# Altium schematic sheet TBD_Sensor.SchDoc
size A4; SheetNumber: 5; SheetTotal: 7
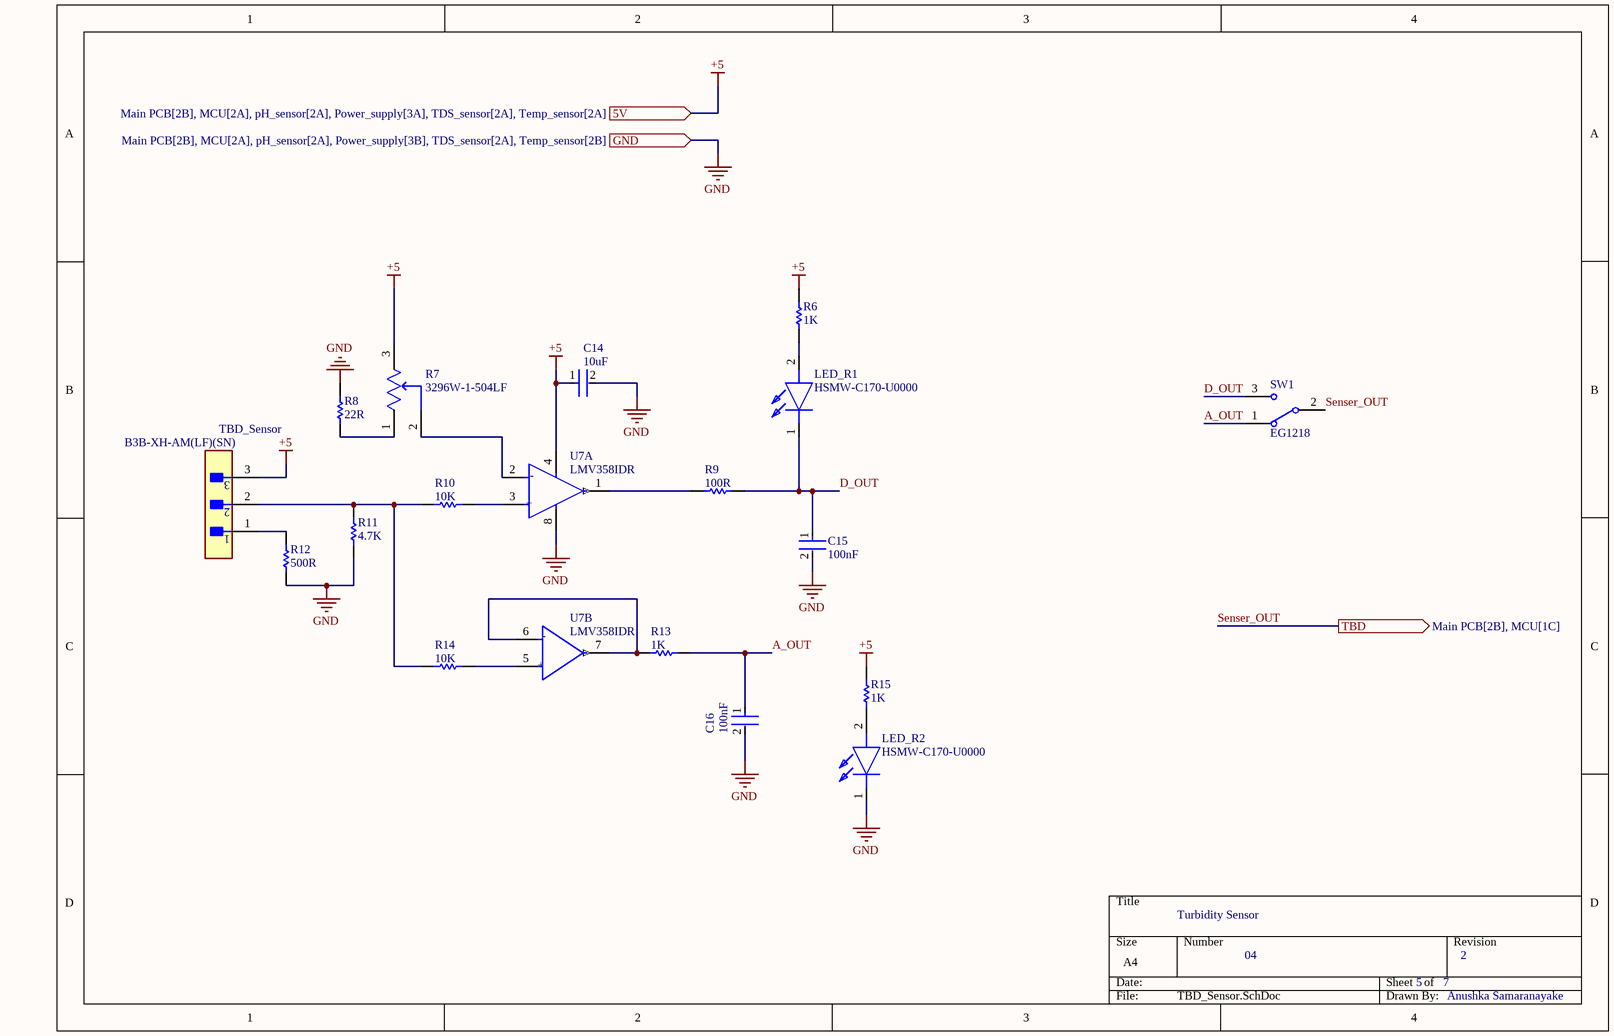
[diagram p0: TBD_Sensor.SchDoc]

## Parts
C14  10uF  [FP-CL31-IPC_B]
C15  100nF  [FP-CL31-IPC_B]
C16  100nF  [FP-CL31-IPC_B]
LED_R1  HSMW-C170-U0000  [LEDC2012X90N]
LED_R2  HSMW-C170-U0000  [LEDC2012X90N]
R6  1K  [RESC3216X70X50LL20T25]
R7  3296W-1-504LF  [FP-3296W-MFG]
R8  22R  [RESC2013X60X35ML10T20]
R9  100R  [RESC2013X60X35ML10T20]
R10  10K  [RESC3216X70X50LL20T25]
R11  4.7K  [RESC3216X70X50LL20T25]
R12  500R  [RESC2013X60X35ML10T20]
R13  1K  [RESC3216X70X50LL20T25]
R14  10K  [RESC3216X70X50LL20T25]
R15  1K  [RESC3216X70X50LL20T25]
SW1  EG1218  [ESWI-EG1218_V]
TBD_Sensor  B3B-XH-AM(LF)(SN)  [FP-B3B-XH-AM_LF_SN-MFG]
U7  LMV358IDR  [FP-D0008A-MFG]  (parts A,B of 2)

## Ports
5V (in, see Main PCB[2B], MCU[2A], pH_sensor[2A], Power_supply[3A], TDS_sensor[2A], Temp_sensor[2A]), GND (in, see Main PCB[2B], MCU[2A], pH_sensor[2A], Power_supply[3B], TDS_sensor[2A], Temp_sensor[2B]), TBD (out, see Main PCB[2B], MCU[1C])

## Nets
+5: C14.1 R6.1 R7.3(CW) R15.1 TBD_Sensor.3 U7.4(GND) ; port 5V
GND: C14.2 C15.2 C16.2 LED_R2.1(K) R8.2 R11.2 R12.1 U7.8(VCC+) ; port GND
A_OUT: C16.1 R13.1 SW1.1
D_OUT: C15.1 LED_R1.1(K) R9.2 SW1.3
Senser_OUT: SW1.2(COM) ; port TBD
NetLED_R1_2: LED_R1.2(A) R6.2
NetLED_R2_2: LED_R2.2(A) R15.2
NetR7_1: R7.1(CCW) R8.1
NetR7_2: R7.2(WIPER) U7.2(1IN-)
NetR9_1: R9.1 U7.1(OUT)
NetR10_1: R10.1 U7.3(1IN+)
NetR10_2: R10.2 R11.1 R14.2 TBD_Sensor.2
NetR12_2: R12.2 TBD_Sensor.1
NetR13_2: R13.2 U7.6(2IN-) U7.7(2OUT)
NetR14_1: R14.1 U7.5(2IN+)

## Notes on the sheet
- Turbidity Sensor
- 04
- 5
- 7
- 2
- Anushka Samaranayake
- (in symbol CMP-04895-000136-1, part A) -; +
- (in symbol CMP-04895-000136-1, part B) -; +

## Library data of the parts
C14-C16 = CMP-13271-001731-1: Cap Ceramic 100nF 50V X7R ±10% SMD 1206 +125°C Embossed T/R; Voltage: 50V; Thickness: 0.037inch; Lead Free: Lead Free; Length: 3.2mm; Min Operating Temperature: -55°C; Package Quantity: 15000; Packaging: Tape and Reel; Mount: Surface Mount; Depth: 1.6mm; Case/Package: 1206; Voltage Rating (DC): 50V; Tolerance: 10%; Height: 0.85mm; Capacitance: 100nF; Radiation Hardening: No; Dielectric: X7R; Voltage Rating: 50V; Max Operating Temperature: 125°C; Width: 0.063inch
LED_R1 LED_R2 = HSMW-C170-U0000: LED; Manufacturer_Name: Avago Technologies; Datasheet Link: https://componentsearchengine.com/Datasheets/2/HSMW-C170-U0000.pdf; Height: 0.9mm; Manufacturer_Part_Number: HSMW-C170-U0000; Mouser Part Number: 630-HSMW-C170-U0000; Mouser Price/Stock: https://www.mouser.co.uk/ProductDetail/Broadcom-Avago/HSMW-C170-U0000?qs=tMOYG%252Bw4%252BLwGyeHODzQdug%3D%3D
R6 R10 R11 R13-R15 = CMP-2003-04407-1: Manufacturer: Panasonic; Part Number: ERA8AEB103V
R7 = CMP-2000-05583-2: TRIMMER 500K OHM 0.5W PC PIN TOP; Manufacturer: Bourns; Resistance: 500kΩ; Temperature Coefficient: 100ppm/°C; Value: 500kΩ; Tolerance: 10%; Voltage Rating: 300V; Standoff Height: 0.38mm; ComponentLink2Description: Datasheet; Package: 3296W; Series: Trimpot 3296-Sealed; Lead Free: Yes; Octopart: https://octopart.com/3296w-1-504lf-bourns-143884; Device Class L2: Resistors; Automotive: No; RoHS: TRUE; Temperature Range High: +125°C; Manufacturer Part Number: 3296W-1-504LF; Height: 12.05mm; Power Rating: 0.5W; Temperature Range Low: -55°C; ComponentLink2URL: https://www.bourns.com/docs/Product-Datasheets/3296.pdf; Device Class L1: Passive Components; Device Class L3: Variable Resistors and Potentiometers; Category: Res; Temperature: -55°C to +125°C; Digikey Description: TRIMMER 500K OHM 0.5W PC PIN TOP; Mouser Description: Trimmer; Cermet; Rest 500 Kilohms; PCB; 25 Turns; Pwr-Rtg 0.5W
R8 R9 R12 = CMP-2100-03671-1: Chip Resistor, 1 KOhm, +/- 1%, 125 mW, -55 to 155 degC, 0805 (2012 Metric), RoHS, Tape and Reel; Manufacturer: Yageo; Temperature Coefficient: 100ppm/degreesC; Voltage Rating (DC): 150V; Max Power Dissipation: 125mW; Resistance: 1KOhm; Number of Pins: 2; Number of Terminations: 2; Datasheet URL: http://www.yageo.com/NewPortal/yageodocoutput?fileName=/pdf/R-Chip/PYu-RC_Group_51_RoHS_L_5.pdf; Length: 0.079inch; Package Description: 2-Pin Surface Mounted Device, Body 2 x 1.25 mm; Depth: 1.25mm; Height: 0.024inch; Military Standard: Not; Case/Package: 0805; Package Reference: 0805; RoHSCompliant: true; Lead Free: LeadFree; Packaging: TapeandReel; Package Quantity: 1; Datasheet Version: Rev. 5, 10/2016; Tolerance: 1%; Min Operating Temperature: -55degC; Voltage Rating: 150V; Composition: ThickFilm; Case Code (Imperial): 0805; Power Rating: 125mW; Width: 0.049inch; Case Code (Metric): 2012; Manufacturer URL: http://www.yageo.com/; Max Operating Temperature: 155degC; REACH SVHC: Unknown; Termination: SMD/SMT
SW1 = CMP-1696-00002-1: Slide Switch, 500 V, -20 to 70 degC, 3-Pin THD, RoHS; Case\Package: SOT-23-5; Output Current: 150 mA; Nominal Output Voltage: 3.3 V; Max Power Dissipation: 250 mW; Min Input Voltage: 4.3 V; Outputs: 1; Max Input Voltage: 8 V; Dropout Voltage: 300 mV; PackageDescription: 3-Pin Through Hole Device, Body 11.6 x 4 mm, Pitch 2.5 mm; ComponentLink1URL: http://www.e-switch.ch/en/; RoHSCompliant: true; Length: 3 mm; ComponentLink1Description: Manufacturer URL; Power Rating: 250 mW; Mount: Surface Mount; Max Operating Temperature: 85 degC; REACH SVHC: No SVHC; Radiation Hardening: No; Height: 1.3 mm; Pins: 5; Max Ouput Current: 150 mA; Output Voltage: 3.3 V; Width: 1.8 mm; Package Quantity: 3000; ComponentLink2URL: https://www.e-switch.com/system/asset/product_line/data_sheet/119/EG.pdf; Min Operating Temperature: -40 degC; ComponentLink2Description: Datasheet; DatasheetVersion: Oct-15; PackageReference: EG1218; Packaging: Tape and Reel
TBD_Sensor = CMP-17438-000009-1: CONN HEADER VERT 3POS 2.5MM; Max Current Rating: 3A; Gender: Male; Max Voltage Rating (AC): 250V; Connector Type: Male Pin; Pitch: 0.098inch; Number of Positions: 3; Contact Resistance: 20mR; Termination: Press-Fit; Housing Color: White; Housing Material: Polyamide; Orientation: Straight; Contact Material: Brass; Contact Type: Male Pin; Color: Natural; Packaging: Bulk; Lead Free: Lead Free; Depth: 5.75mm; Number of Rows: 1; Contact Plating: Tin; Length: 9.9mm; Max Operating Temperature: 85°C; Series: XH; Min Operating Temperature: -25°C; Fastening Type: Detent; Mount: Through Hole
U7 = CMP-04895-000136-1: IC OPAMP GP 2 CIRCUIT 8SOIC; Number of Elements: 2; Min Supply Voltage: 2.7V; Input Bias Current: 250nA; Output Current per Channel: 160mA; Bandwidth: 1MHz; Voltage Gain: 100dB; Input Offset Voltage (Vos): 7mV; Slew Rate: 1V/µs; Nominal Supply Current: 440uA; Power Supply Rejection Ratio (PSRR): 50dB; Max Supply Voltage: 5.5V; Operating Supply Current: 210uA; Lead Free: Lead Free; Length: 4.9mm; RoHS Compliant: Yes; REACH SVHC: No SVHC; Case/Package: SOIC; Height: 1.58mm; Number of Channels: 2; Number of Amplifiers: 2; Radiation Hardening: No; Number of Circuits: 2; Mount: Surface Mount; Contact Plating: Gold; Unity Gain Bandwidth Product: 1MHz; Min Operating Temperature: -40°C; Max Operating Temperature: 125°C; Width: 3.91mm; Gain Bandwidth Product: 1MHz; Number of Pins: 8; Packaging: Tape and Reel; Package Quantity: 2500; Output Current: 160mA; Common Mode Rejection Ratio: 50dB